# EAGLE design Handle 2019 - STM32 (EAGLE 9.3.1)
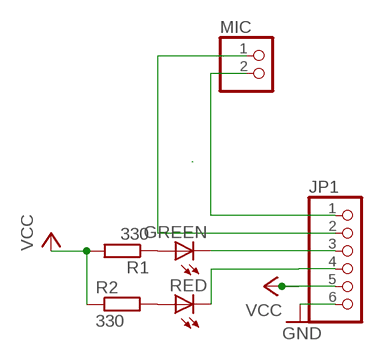
[diagram p0: schematic, sheet 1]

## Parts
GREEN  LED5MM  [LED5MM]
JP1  PINHD-1X6  [1X06]
MIC  PINHD-1X2  [1X02]
R1  330  R-EU_M1206  [M1206]
R2  330  R-EU_M1206  [M1206]
RED  LED5MM  [LED5MM]

## Nets
GND: JP1.6
N$8: GREEN.K(C) JP1.3
N$9: JP1.2 MIC.1
N$10: JP1.1 MIC.2
N$13: GREEN.A R1.1
N$14: R2.2 RED.A
N$16: JP1.4 RED.K(C)
VCC: JP1.5 R1.2 R2.1

## Library data of the parts
GREEN RED = led:LED: LED OSRAM: - CHIPLED LG R971, LG N971, LY N971, LG Q971, LY Q971, LO R971, LY R971 LH N974, LH R974 LS Q976, LO Q976, LY Q976 LO Q996 - Hyper CHIPLED LW Q18S LB Q993, LB Q99A, LB R99A - SideLED LS A670, LO A670, LY A670, LG A670, LP A670 LB A673, LV A673, LT A673, LW A673 LH A674 LY A675 LS A676, LA A676, LO A676, LY A676, LW A676 LS A679, LY A679, LG A679 - Hyper Micro SIDELED® LS Y876, LA Y876, LO Y876, LY Y876 LT Y87S - SmartLED LW L88C, LW L88S LB L89C, LB L89S, LG L890 LS L89K, LO L89K, LY L89K LS L896, LA L896, LO L896, LY L896 - TOPLED LS T670, LO T670, LY T670, LG T670, LP T670 LSG T670, LSP T670, LSY T670, LOP T670, LYG T670 LG T671, LOG T671, LSG T671 LB T673, LV T673, LT T673, LW T673 LH T674 LS T676, LA T676, LO T676, LY T676, LB T676, LH T676, LSB T676, LW T676 LB T67C, LV T67C, LT T67C, LS T67K, LO T67K, LY T67K, LW E67C LS E67B, LA E67B, LO E67B, LY E67B, LB E67C, LV E67C, LT E67C LW T67C LS T679, LY T679, LG T679 LS T770, LO T770, LY T770, LG T770, LP T770 LB T773, LV T773, LT T773, LW T773 LH T774 LS E675, LA E675, LY E675, LS T675 LS T776, LA T776, LO T776, LY T776, LB T776 LHGB T686 LT T68C, LB T68C - Hyper Mini TOPLED® LB M676 - Mini TOPLED Santana® LG M470 LS M47K, LO M47K, LY M47K Source: http://www.osram.convergy.de LUXEON: - LUMILED® LXK2-PW12-R00, LXK2-PW12-S00, LXK2-PW14-U00, LXK2-PW14-V00 LXK2-PM12-R00, LXK2-PM12-S00, LXK2-PM14-U00 LXK2-PE12-Q00, LXK2-PE12-R00, LXK2-PE12-S00, LXK2-PE14-T00, LXK2-PE14-U00 LXK2-PB12-K00, LXK2-PB12-L00, LXK2-PB12-M00, LXK2-PB14-N00, LXK2-PB14-P00, LXK2-PB14-Q00 LXK2-PR12-L00, LXK2-PR12-M00, LXK2-PR14-Q00, LXK2-PR14-R00 LXK2-PD12-Q00, LXK2-PD12-R00, LXK2-PD12-S00 LXK2-PH12-R00, LXK2-PH12-S00 LXK2-PL12-P00, LXK2-PL12-Q00, LXK2-PL12-R00 Source: www.luxeon.com KINGBRIGHT: KA-3528ASYC Source: www.kingbright.com
JP1 = pinhead:PINHD-1X6: PIN HEADER
MIC = pinhead:PINHD-1X2: PIN HEADER
R1 R2 = resistor:R-EU_: RESISTOR, European symbol

## Board
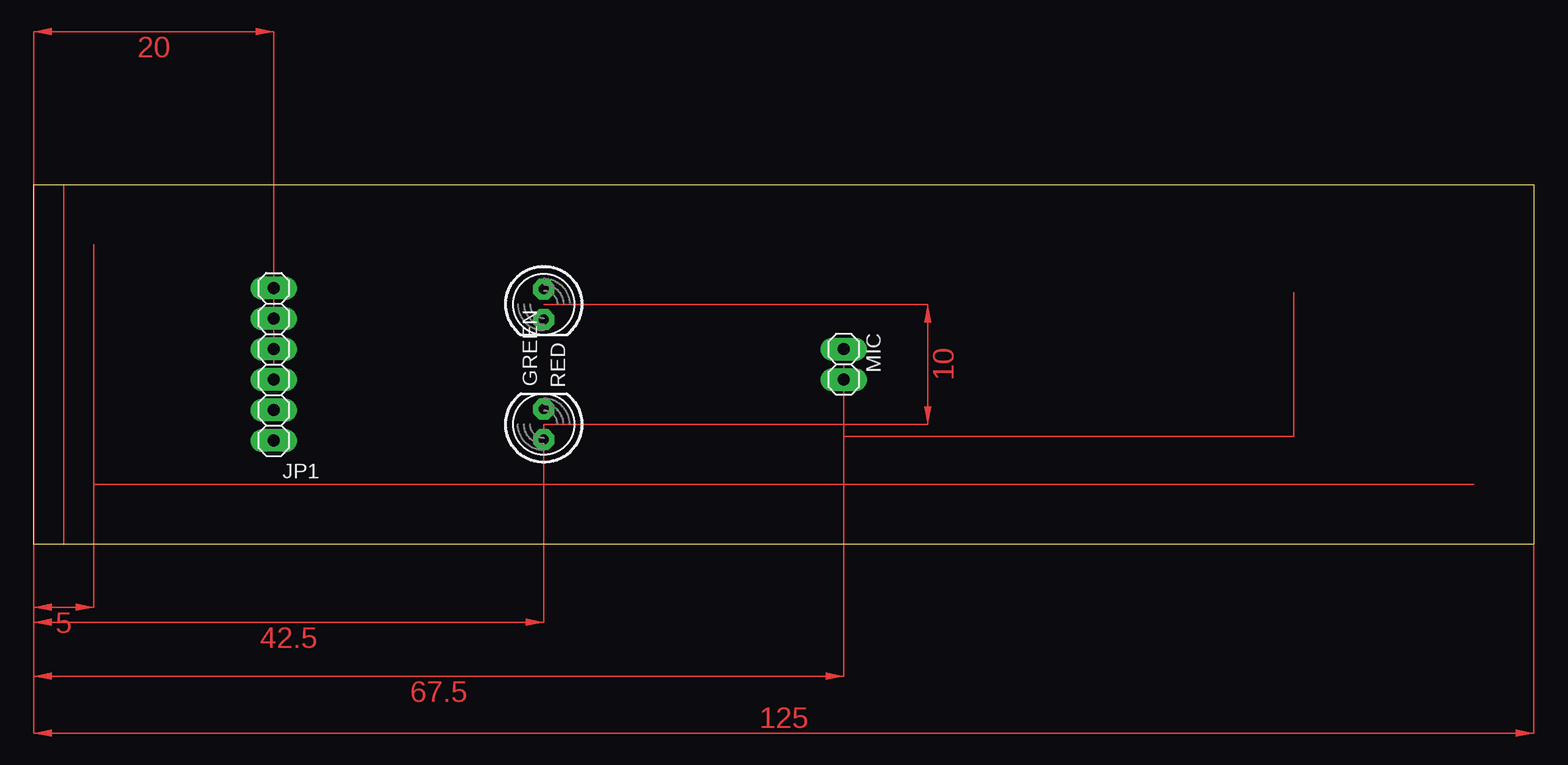
[diagram p1: board, top side]
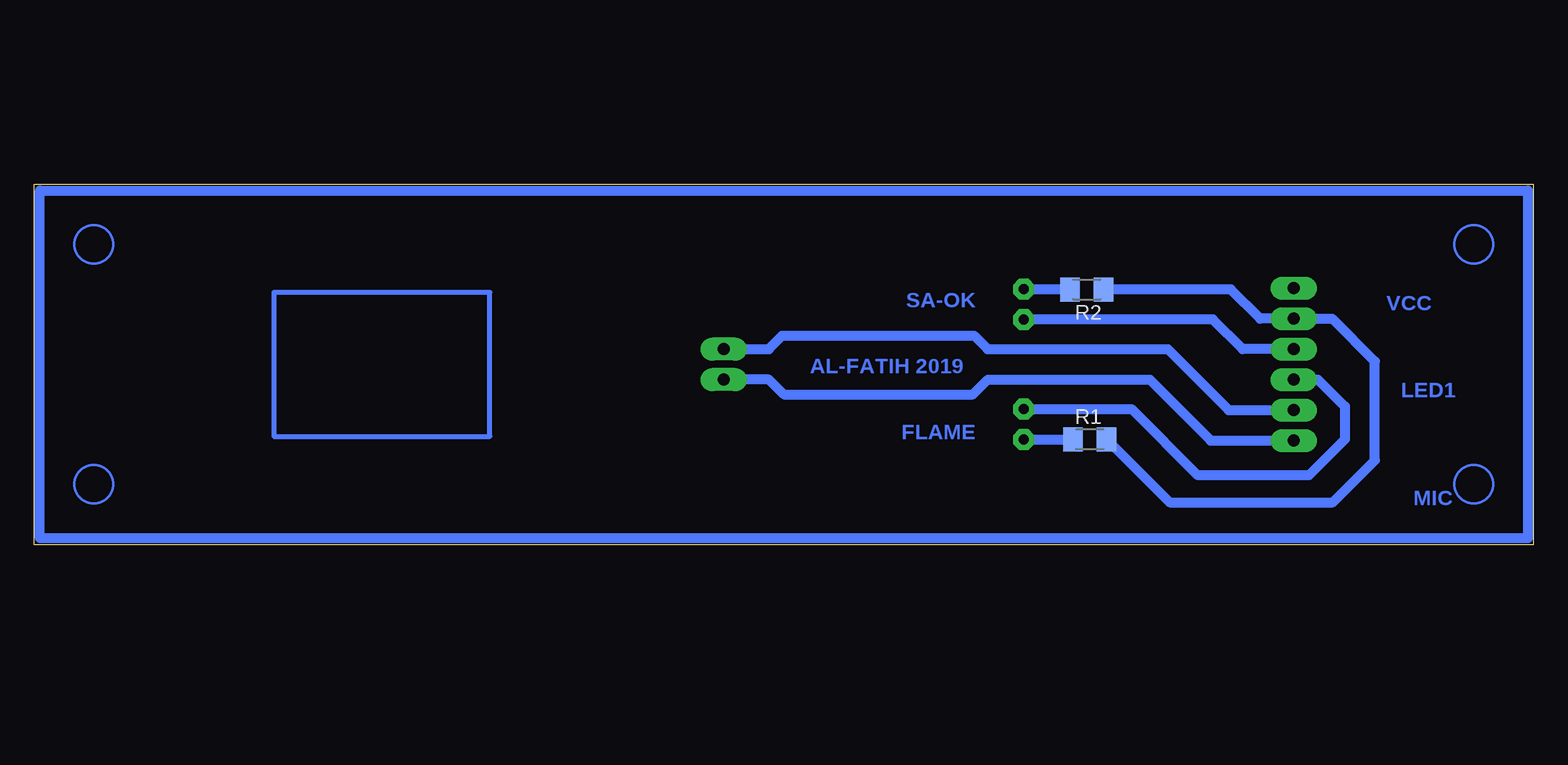
[diagram p2: board, bottom side, seen from below]

Size 125 x 30 mm. Coordinates in mm from the lower left corner, seen from the top.
Outline: 125,0 0,0 0,30 125,30 125,0
Copper layers (1*16): Top 0.035mm / dielectric 1.5mm / Bottom 0.035mm
Design rules "default *": minimum track width 6mil, minimum drill 0.35mm, track to track 6mil, track to pad 6mil, pad to pad 6mil, via to via 6mil, smd to smd 6mil, copper to edge 40mil, drill to drill 6mil, minimum pad ring 18mil, minimum via ring 8mil, stop-mask expansion 4mil, vias tented up to drill 0mil, thermal gap 10mil

### Footprints (pad centres in the part's own frame; a part is rotated, then mirrored left to right if it is on the bottom)
LED5MM = drill 0.813 octagon: A -1.27,0; K 1.27,0
1X06 = drill 1.016 long: 1 -6.35,0; 2 -3.81,0; 3 -1.27,0; 4 1.27,0; 5 3.81,0; 6 6.35,0
1X02 = drill 1.016 long: 1 -1.27,0; 2 1.27,0
M1206 = smd 1.6 x 2: 1 -1.4,0; 2 1.4,0

### Placement (x,y rotation side)
GREEN  42.5,10 90 top
JP1  20,15 90 top
MIC  67.5,15 270 top
R1  37,8.75 0 bottom
R2  37.25,21.25 180 bottom
RED  42.5,20 270 top

### Tracks (layer width: path | path; a pad name or v marks a point on that pad's centre or on a via)
N$2
  Bottom 0.813: 124.5,0.5 124.5,29.5 0.5,29.5 0.5,0.5 124.5,0.5
N$3
  Bottom 0.406: 105,9 87,9 87,21 105,21 105,9
N$8
  Bottom 0.813: GREEN.K 33.52,11.27 28,5.75 18.75,5.75 15.75,8.75 15.75,11.5 17.98,13.73 JP1.3
N$9
  Bottom 0.813: MIC.1 63.75,16.27 62.63,17.38 46.63,17.38 45.52,16.27 30.5,16.27 25.42,11.19 JP1.2
N$10
  Bottom 0.813: MIC.2 63.73,13.73 62.5,12.5 46.73,12.5 45.5,13.73 32,13.73 26.92,8.65 JP1.1
N$13
  Bottom 0.813: GREEN.A 42.48,8.75 R1.1
N$14
  Bottom 0.813: R2.2 42.48,21.25 RED.A
N$16
  Bottom 0.813: RED.K 42.48,18.75 26.75,18.75 24.27,16.27 JP1.4
VCC
  Bottom 0.813: R1.2 30.35,3.5 16.75,3.5 13.25,7 13.25,15.25 16.81,18.81 JP1.5 22.81,18.81 25.25,21.25 R2.1
(copper drawn outside any net)
  shapes: Bottom circle x4, Top area x12

### Text on the board
Top: Diameter Mic: 10 mm | Diameter LED: 6,5 mm
Bottom: VCC | SA-OK | AL-FATIH 2019 | LED1 | FLAME | MIC